# Altium schematic sheet fpga_connectors.SchDoc
size A; SheetNumber: 5; SheetTotal: 7
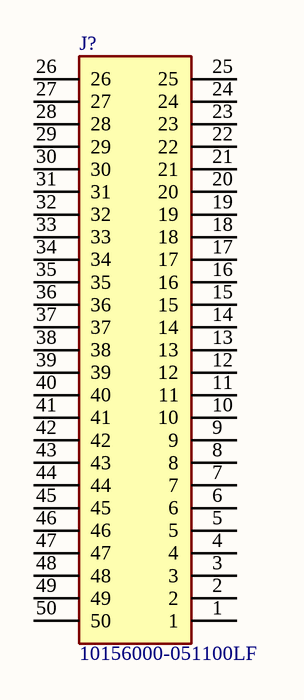
[diagram p0: fpga_connectors.SchDoc]

## Parts
J?  10156000-051100LF  [10156000051100LF]

## Nets

Not connected (* = marked no-connect by the designer): J? 1 2 3 4 5 6 7 8 9 10 11 12 13 14 15 16 17 18 19 20 21 22 23 24 25 26 27 28 29 30 31 32 33 34 35 36 37 38 39 40 41 42 43 44 45 46 47 48 49 50

## Library data of the parts
J? = 10156000-051100LF: Connector; Manufacturer_Name: Amphenol Communications Solutions; Datasheet Link: https://cdn.amphenol-cs.com/media/wysiwyg/files/drawing/10156000.pdf; Height: 2.75mm; Manufacturer_Part_Number: 10156000-051100LF; Mouser Part Number: 649-10156000051100LF; Mouser Price/Stock: https://www.mouser.co.uk/ProductDetail/Amphenol-FCI/10156000-051100LF?qs=OlC7AqGiEDkwVvafwguADw%3D%3D